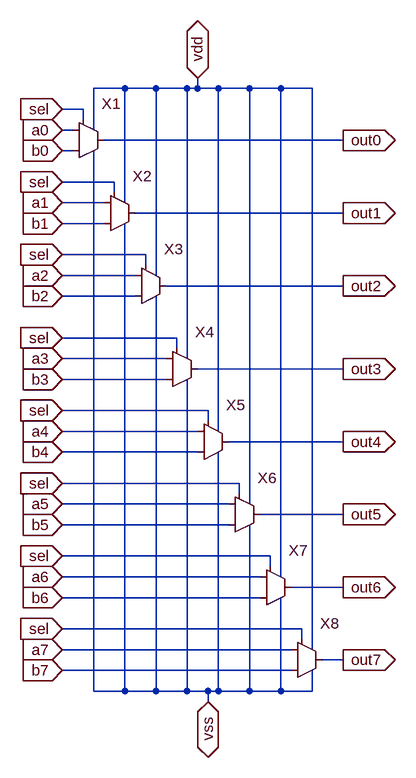
[diagram p0: schematic 8_bit_mux.asc]
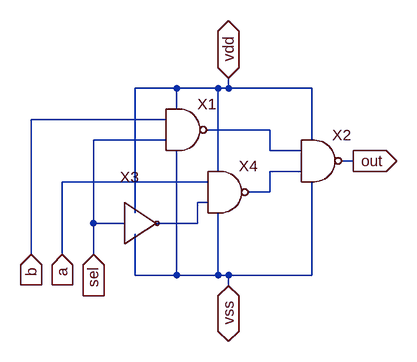
[diagram p1: sub-circuit mux.asc]
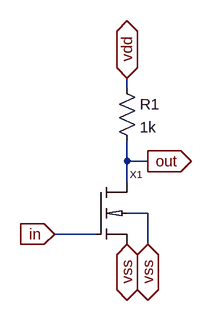
[diagram p2: sub-circuit not.asc]
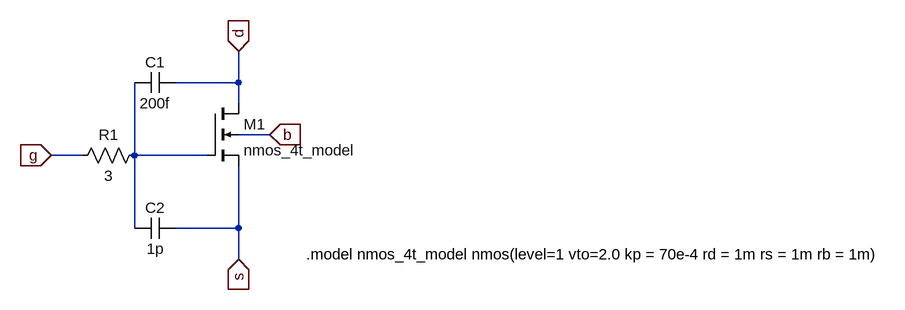
[diagram p3: sub-circuit nmos_4t.asc]
8_bit_mux.asc, the LTspice schematic file:
Version 4
SHEET 1 880 1036
WIRE 272 -48 224 -48
WIRE 320 -48 272 -48
WIRE 368 -48 320 -48
WIRE 384 -48 384 -64
WIRE 384 -48 368 -48
WIRE 416 -48 384 -48
WIRE 464 -48 416 -48
WIRE 512 -48 464 -48
WIRE 560 -48 512 -48
WIRE 208 -16 176 -16
WIRE 208 0 208 -16
WIRE 192 16 176 16
WIRE 224 16 224 -48
WIRE 608 32 240 32
WIRE 192 48 176 48
WIRE 256 96 176 96
WIRE 256 112 256 96
WIRE 240 128 176 128
WIRE 272 128 272 -48
WIRE 608 144 288 144
WIRE 240 160 176 160
WIRE 304 208 176 208
WIRE 304 224 304 208
WIRE 288 240 176 240
WIRE 320 240 320 -48
WIRE 608 256 336 256
WIRE 288 272 176 272
WIRE 352 336 176 336
WIRE 352 352 352 336
WIRE 336 368 176 368
WIRE 368 368 368 -48
WIRE 608 384 384 384
WIRE 336 400 176 400
WIRE 400 448 176 448
WIRE 400 464 400 448
WIRE 384 480 176 480
WIRE 416 480 416 -48
WIRE 608 496 432 496
WIRE 384 512 176 512
WIRE 448 560 176 560
WIRE 448 576 448 560
WIRE 432 592 176 592
WIRE 464 592 464 -48
WIRE 608 608 480 608
WIRE 432 624 176 624
WIRE 496 672 176 672
WIRE 496 688 496 672
WIRE 480 704 176 704
WIRE 512 704 512 -48
WIRE 608 720 528 720
WIRE 480 736 176 736
WIRE 544 784 176 784
WIRE 544 800 544 784
WIRE 528 816 176 816
WIRE 560 816 560 -48
WIRE 608 832 576 832
WIRE 528 848 176 848
WIRE 224 880 224 48
WIRE 272 880 272 160
WIRE 272 880 224 880
WIRE 320 880 320 272
WIRE 320 880 272 880
WIRE 368 880 368 400
WIRE 368 880 320 880
WIRE 400 880 368 880
WIRE 416 880 416 512
WIRE 416 880 400 880
WIRE 464 880 464 624
WIRE 464 880 416 880
WIRE 512 880 512 736
WIRE 512 880 464 880
WIRE 560 880 560 848
WIRE 560 880 512 880
WIRE 400 896 400 880
FLAG 176 16 a0
IOPIN 176 16 In
FLAG 176 48 b0
IOPIN 176 48 In
FLAG 176 128 a1
IOPIN 176 128 In
FLAG 176 160 b1
IOPIN 176 160 In
FLAG 176 272 b2
IOPIN 176 272 In
FLAG 176 240 a2
IOPIN 176 240 In
FLAG 176 400 b3
IOPIN 176 400 In
FLAG 176 368 a3
IOPIN 176 368 In
FLAG 176 512 b4
IOPIN 176 512 In
FLAG 176 480 a4
IOPIN 176 480 In
FLAG 176 624 b5
IOPIN 176 624 In
FLAG 176 592 a5
IOPIN 176 592 In
FLAG 176 736 b6
IOPIN 176 736 In
FLAG 176 704 a6
IOPIN 176 704 In
FLAG 176 848 b7
IOPIN 176 848 In
FLAG 176 816 a7
IOPIN 176 816 In
FLAG 608 32 out0
IOPIN 608 32 Out
FLAG 608 144 out1
IOPIN 608 144 Out
FLAG 608 256 out2
IOPIN 608 256 Out
FLAG 608 384 out3
IOPIN 608 384 Out
FLAG 608 496 out4
IOPIN 608 496 Out
FLAG 608 608 out5
IOPIN 608 608 Out
FLAG 608 720 out6
IOPIN 608 720 Out
FLAG 608 832 out7
IOPIN 608 832 Out
FLAG 176 -16 sel
IOPIN 176 -16 In
FLAG 176 96 sel
IOPIN 176 96 In
FLAG 176 208 sel
IOPIN 176 208 In
FLAG 176 336 sel
IOPIN 176 336 In
FLAG 176 448 sel
IOPIN 176 448 In
FLAG 176 560 sel
IOPIN 176 560 In
FLAG 176 672 sel
IOPIN 176 672 In
FLAG 176 784 sel
IOPIN 176 784 In
FLAG 384 -64 vdd
IOPIN 384 -64 BiDir
FLAG 400 896 vss
IOPIN 400 896 BiDir
SYMBOL mux 208 32 R0
SYMATTR InstName X1
SYMBOL mux 256 144 R0
SYMATTR InstName X2
SYMBOL mux 304 256 R0
SYMATTR InstName X3
SYMBOL mux 352 384 R0
SYMATTR InstName X4
SYMBOL mux 400 496 R0
SYMATTR InstName X5
SYMBOL mux 448 608 R0
SYMATTR InstName X6
SYMBOL mux 496 720 R0
SYMATTR InstName X7
SYMBOL mux 544 832 R0
SYMATTR InstName X8

mux.asc, the sub-circuit schematic file:
Version 4
SHEET 1 880 680
WIRE 112 32 48 32
WIRE 176 32 112 32
WIRE 192 32 192 16
WIRE 192 32 176 32
WIRE 320 32 192 32
WIRE 112 64 112 32
WIRE 96 80 -112 80
WIRE 256 96 160 96
WIRE 96 112 -16 112
WIRE 320 112 320 32
WIRE 256 128 256 96
WIRE 304 128 256 128
WIRE 384 144 368 144
WIRE 176 160 176 32
WIRE 304 160 256 160
WIRE 160 176 -64 176
WIRE 256 192 256 160
WIRE 256 192 224 192
WIRE 160 208 144 208
WIRE 48 224 48 32
WIRE -16 240 -16 112
WIRE 32 240 -16 240
WIRE 144 240 144 208
WIRE 144 240 80 240
WIRE -112 288 -112 80
WIRE -64 288 -64 176
WIRE -16 288 -16 240
WIRE 48 320 48 256
WIRE 112 320 112 128
WIRE 112 320 48 320
WIRE 176 320 176 224
WIRE 176 320 112 320
WIRE 192 320 176 320
WIRE 320 320 320 176
WIRE 320 320 192 320
WIRE 192 336 192 320
FLAG -64 288 a
IOPIN -64 288 In
FLAG -112 288 b
IOPIN -112 288 In
FLAG -16 288 sel
IOPIN -16 288 In
FLAG 192 336 vss
IOPIN 192 336 BiDir
FLAG 192 16 vdd
IOPIN 192 16 BiDir
FLAG 384 144 out
IOPIN 384 144 Out
SYMBOL not 32 240 R0
SYMATTR InstName X3
SYMBOL nand 128 32 R0
SYMATTR InstName X1
SYMBOL nand 336 80 R0
SYMATTR InstName X2
SYMBOL nand 192 128 R0
SYMATTR InstName X4

not.asc, the sub-circuit schematic file:
Version 4
SHEET 1 880 680
WIRE 176 -96 176 -112
WIRE 176 16 176 -16
WIRE 208 16 176 16
WIRE 176 48 176 16
WIRE 208 96 176 96
WIRE 128 128 64 128
WIRE 208 144 208 96
FLAG 64 128 in
IOPIN 64 128 In
FLAG 176 144 vss
IOPIN 176 144 BiDir
FLAG 176 -112 vdd
IOPIN 176 -112 BiDir
FLAG 208 16 out
IOPIN 208 16 Out
FLAG 208 144 vss
IOPIN 208 144 BiDir
SYMBOL res 160 -112 R0
SYMATTR InstName R1
SYMATTR Value 1k
SYMBOL nmos_4t 128 48 R0
SYMATTR InstName X1

nmos_4t.asc, the sub-circuit schematic file:
Version 4
SHEET 1 880 680
WIRE -288 -224 -288 -272
WIRE -288 -224 -384 -224
WIRE -288 -192 -288 -224
WIRE -240 -144 -288 -144
WIRE -528 -112 -576 -112
WIRE -448 -112 -448 -224
WIRE -336 -112 -448 -112
WIRE -448 0 -448 -112
WIRE -288 0 -288 -96
WIRE -288 0 -384 0
WIRE -288 48 -288 0
FLAG -576 -112 g
IOPIN -576 -112 In
FLAG -288 -272 d
IOPIN -288 -272 In
FLAG -288 48 s
IOPIN -288 48 In
FLAG -240 -144 b
IOPIN -240 -144 In
SYMBOL nmos4 -336 -192 R0
SYMATTR InstName M1
SYMATTR Value nmos_4t_model
SYMBOL cap -384 -240 R90
WINDOW 0 0 32 VBottom 2
WINDOW 3 32 32 VTop 2
SYMATTR InstName C1
SYMATTR Value 200f
SYMBOL cap -384 -16 R90
WINDOW 0 0 32 VBottom 2
WINDOW 3 32 32 VTop 2
SYMATTR InstName C2
SYMATTR Value 1p
SYMBOL res -432 -128 R90
WINDOW 0 0 56 VBottom 2
WINDOW 3 32 56 VTop 2
SYMATTR InstName R1
SYMATTR Value 3
TEXT -184 40 Left 2 !.model nmos_4t_model nmos(level=1 vto=2.0 kp = 70e-4 rd = 1m rs = 1m rb = 1m)

The netlist it stands for:
* 8_bit_mux.asc
XX1 a0 b0 sel out0 vdd vss mux
XX2 a1 b1 sel out1 vdd vss mux
XX3 a2 b2 sel out2 vdd vss mux
XX4 a3 b3 sel out3 vdd vss mux
XX5 a4 b4 sel out4 vdd vss mux
XX6 a5 b5 sel out5 vdd vss mux
XX7 a6 b6 sel out6 vdd vss mux
XX8 a7 b7 sel out7 vdd vss mux

* block symbol definitions
.subckt mux a b sel out vdd vss
XX3 sel N003 vss vdd not
XX1 b sel vdd vss N001 nand  ; pins a b vdd vss out
XX2 N001 N002 vdd vss out nand  ; pins a b vdd vss out
XX4 a N003 vdd vss N002 nand  ; pins a b vdd vss out
.ends mux

.subckt not in out vss vdd
R1 vdd out 1k
XX1 out in vss vss nmos_4t
.ends not

.subckt nmos_4t D G S B
M1 d N001 s b nmos_4t_model
C1 d N001 200f
C2 s N001 1p
R1 N001 g 3
.model nmos_4t_model nmos(level=1 vto=2.0 kp = 70e-4 rd = 1m rs = 1m rb = 1m)
.ends nmos_4t

.model NMOS NMOS
.model PMOS PMOS
.lib standard.mos
.backanno
.end